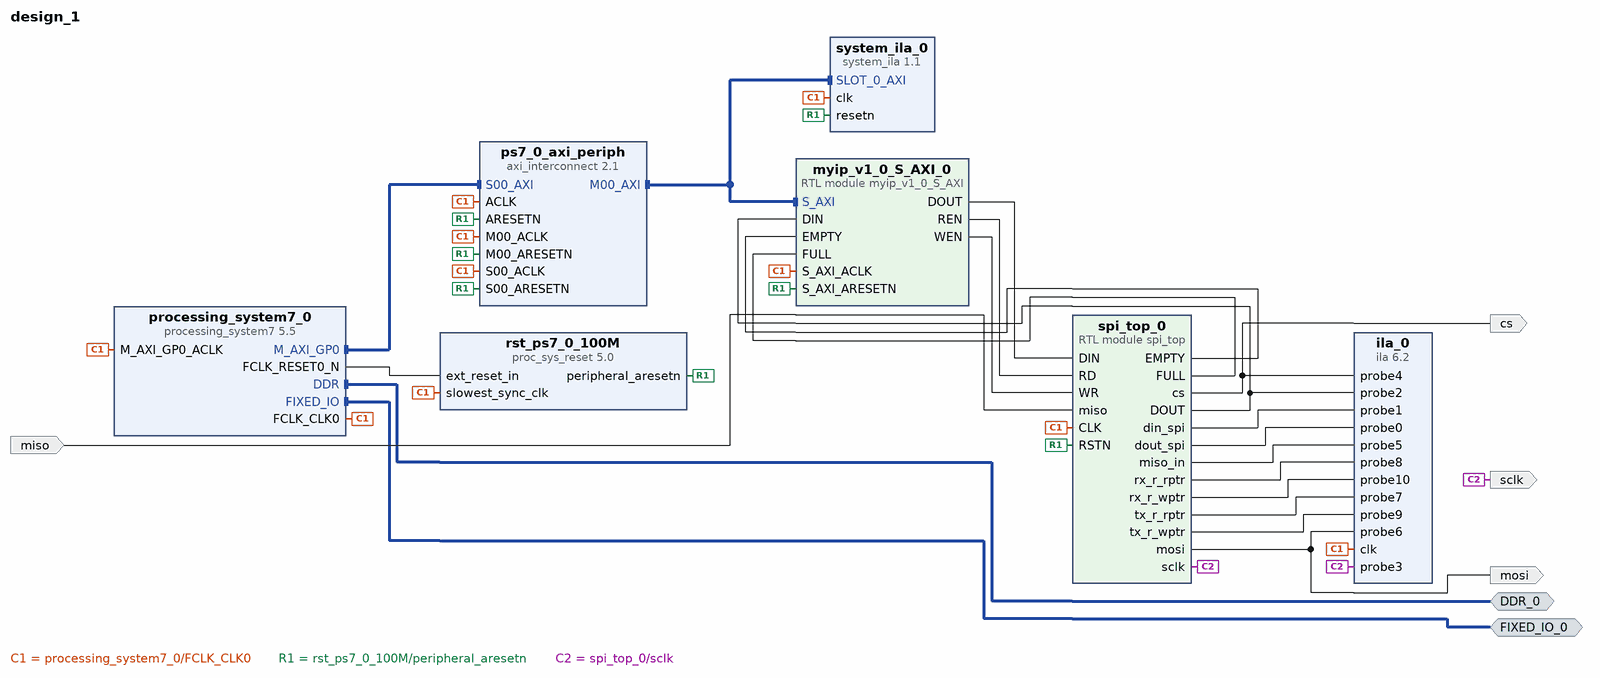
[diagram p0: block diagram of the top level]
# Vivado block design design_1, xc7z007sclg400-1, Vivado 2024.1
create_bd_design design_1

create_bd_intf_port -mode Master -vlnv xilinx.com:interface:ddrx_rtl:1.0 DDR_0
create_bd_intf_port -mode Master -vlnv xilinx.com:display_processing_system7:fixedio_rtl:1.0 FIXED_IO_0
create_bd_port -dir O mosi
create_bd_port -dir O sclk
create_bd_port -dir O cs
create_bd_port -dir I miso

create_bd_cell -type module -reference myip_v1_0_S_AXI myip_v1_0_S_AXI_0
create_bd_cell -type ip -vlnv xilinx.com:ip:axi_interconnect:2.1 ps7_0_axi_periph
set_property -dict {CONFIG.NUM_MI 1} [get_bd_cells ps7_0_axi_periph]
create_bd_cell -type ip -vlnv xilinx.com:ip:proc_sys_reset:5.0 rst_ps7_0_100M
create_bd_cell -type module -reference spi_top spi_top_0
create_bd_cell -type ip -vlnv xilinx.com:ip:processing_system7:5.5 processing_system7_0
set_property -dict [list \
  CONFIG.PCW_APU_PERIPHERAL_FREQMHZ 650 \
  CONFIG.PCW_CRYSTAL_PERIPHERAL_FREQMHZ 50 \
  CONFIG.PCW_ENET0_ENET0_IO {MIO 16 .. 27} \
  CONFIG.PCW_ENET0_GRP_MDIO_ENABLE 1 \
  CONFIG.PCW_ENET0_GRP_MDIO_IO {MIO 52 .. 53} \
  CONFIG.PCW_ENET0_PERIPHERAL_ENABLE 1 \
  CONFIG.PCW_ENET0_RESET_ENABLE 1 \
  CONFIG.PCW_ENET0_RESET_IO {MIO 9} \
  CONFIG.PCW_ENET_RESET_ENABLE 1 \
  CONFIG.PCW_ENET_RESET_SELECT {Share reset pin} \
  CONFIG.PCW_FPGA0_PERIPHERAL_FREQMHZ 100 \
  CONFIG.PCW_GPIO_MIO_GPIO_ENABLE 1 \
  CONFIG.PCW_GPIO_MIO_GPIO_IO MIO \
  CONFIG.PCW_I2C_RESET_ENABLE 1 \
  CONFIG.PCW_PRESET_BANK1_VOLTAGE {LVCMOS 1.8V} \
  CONFIG.PCW_QSPI_PERIPHERAL_ENABLE 0 \
  CONFIG.PCW_SD0_GRP_CD_ENABLE 1 \
  CONFIG.PCW_SD0_GRP_CD_IO {MIO 47} \
  CONFIG.PCW_SD0_GRP_WP_ENABLE 0 \
  CONFIG.PCW_SD0_PERIPHERAL_ENABLE 1 \
  CONFIG.PCW_SD0_SD0_IO {MIO 40 .. 45} \
  CONFIG.PCW_SDIO_PERIPHERAL_FREQMHZ 100 \
  CONFIG.PCW_UART0_PERIPHERAL_ENABLE 1 \
  CONFIG.PCW_UART0_UART0_IO {MIO 14 .. 15} \
  CONFIG.PCW_UART_PERIPHERAL_FREQMHZ 100 \
  CONFIG.PCW_UIPARAM_DDR_BUS_WIDTH {16 Bit} \
  CONFIG.PCW_UIPARAM_DDR_FREQ_MHZ 525 \
  CONFIG.PCW_UIPARAM_DDR_PARTNO {MT41K256M16 RE-125} \
  CONFIG.PCW_USB0_PERIPHERAL_ENABLE 0 \
  CONFIG.PCW_USB0_RESET_ENABLE 1 \
  CONFIG.PCW_USB0_RESET_IO {MIO 46} \
  CONFIG.PCW_USB_RESET_ENABLE 1 \
] [get_bd_cells processing_system7_0]
# 292 more settings of processing_system7_0 are not shown: defaults, MIO pin electricals, DDR timing, and values the tool derives
create_bd_cell -type ip -vlnv xilinx.com:ip:system_ila:1.1 system_ila_0
set_property -dict {CONFIG.C_MON_TYPE INTERFACE} [get_bd_cells system_ila_0]
create_bd_cell -type ip -vlnv xilinx.com:ip:ila:6.2 ila_0
set_property -dict [list \
  CONFIG.C_MONITOR_TYPE Native \
  CONFIG.C_NUM_OF_PROBES 11 \
  CONFIG.C_PROBE0_WIDTH 8 \
  CONFIG.C_PROBE10_WIDTH 4 \
  CONFIG.C_PROBE1_WIDTH 8 \
  CONFIG.C_PROBE2_WIDTH 8 \
  CONFIG.C_PROBE3_WIDTH 1 \
  CONFIG.C_PROBE7_WIDTH 4 \
  CONFIG.C_PROBE8_WIDTH 4 \
  CONFIG.C_PROBE9_WIDTH 4 \
] [get_bd_cells ila_0]

# ---- connections ----

connect_bd_intf_net [get_bd_intf_ports DDR_0] [get_bd_intf_pins processing_system7_0/DDR]
connect_bd_intf_net [get_bd_intf_ports FIXED_IO_0] [get_bd_intf_pins processing_system7_0/FIXED_IO]
connect_bd_intf_net [get_bd_intf_pins processing_system7_0/M_AXI_GP0] [get_bd_intf_pins ps7_0_axi_periph/S00_AXI]
connect_bd_intf_net -intf_net ps7_0_axi_periph_M00_AXI [get_bd_intf_pins ps7_0_axi_periph/M00_AXI] [get_bd_intf_pins myip_v1_0_S_AXI_0/S_AXI]
connect_bd_intf_net [get_bd_intf_pins ps7_0_axi_periph/M00_AXI] [get_bd_intf_pins system_ila_0/SLOT_0_AXI]
connect_bd_net [get_bd_ports miso] [get_bd_pins spi_top_0/miso]
connect_bd_net [get_bd_pins myip_v1_0_S_AXI_0/DOUT] [get_bd_pins spi_top_0/DIN]
connect_bd_net [get_bd_pins myip_v1_0_S_AXI_0/REN] [get_bd_pins spi_top_0/RD]
connect_bd_net [get_bd_pins myip_v1_0_S_AXI_0/WEN] [get_bd_pins spi_top_0/WR]
connect_bd_net [get_bd_pins processing_system7_0/FCLK_CLK0] \
  [get_bd_pins rst_ps7_0_100M/slowest_sync_clk] [get_bd_pins processing_system7_0/M_AXI_GP0_ACLK] [get_bd_pins ila_0/clk] \
  [get_bd_pins ps7_0_axi_periph/ACLK] [get_bd_pins ps7_0_axi_periph/S00_ACLK] [get_bd_pins ps7_0_axi_periph/M00_ACLK] \
  [get_bd_pins system_ila_0/clk] [get_bd_pins spi_top_0/CLK] [get_bd_pins myip_v1_0_S_AXI_0/S_AXI_ACLK]
connect_bd_net [get_bd_pins processing_system7_0/FCLK_RESET0_N] [get_bd_pins rst_ps7_0_100M/ext_reset_in]
connect_bd_net [get_bd_pins rst_ps7_0_100M/peripheral_aresetn] \
  [get_bd_pins ps7_0_axi_periph/ARESETN] [get_bd_pins ps7_0_axi_periph/S00_ARESETN] \
  [get_bd_pins ps7_0_axi_periph/M00_ARESETN] [get_bd_pins system_ila_0/resetn] [get_bd_pins spi_top_0/RSTN] \
  [get_bd_pins myip_v1_0_S_AXI_0/S_AXI_ARESETN]
connect_bd_net [get_bd_pins spi_top_0/DOUT] [get_bd_pins ila_0/probe2] [get_bd_pins myip_v1_0_S_AXI_0/DIN]
connect_bd_net [get_bd_pins spi_top_0/EMPTY] [get_bd_pins myip_v1_0_S_AXI_0/EMPTY]
connect_bd_net [get_bd_pins spi_top_0/FULL] [get_bd_pins myip_v1_0_S_AXI_0/FULL]
connect_bd_net [get_bd_pins spi_top_0/cs] [get_bd_pins ila_0/probe4] [get_bd_ports cs]
connect_bd_net [get_bd_pins spi_top_0/din_spi] [get_bd_pins ila_0/probe1]
connect_bd_net [get_bd_pins spi_top_0/dout_spi] [get_bd_pins ila_0/probe0]
connect_bd_net [get_bd_pins spi_top_0/miso_in] [get_bd_pins ila_0/probe5]
connect_bd_net [get_bd_pins spi_top_0/mosi] [get_bd_ports mosi] [get_bd_pins ila_0/probe6]
connect_bd_net [get_bd_pins spi_top_0/rx_r_rptr] [get_bd_pins ila_0/probe8]
connect_bd_net [get_bd_pins spi_top_0/rx_r_wptr] [get_bd_pins ila_0/probe10]
connect_bd_net [get_bd_pins spi_top_0/sclk] [get_bd_pins ila_0/probe3] [get_bd_ports sclk]
connect_bd_net [get_bd_pins spi_top_0/tx_r_rptr] [get_bd_pins ila_0/probe7]
connect_bd_net [get_bd_pins spi_top_0/tx_r_wptr] [get_bd_pins ila_0/probe9]
set_property HDL_ATTRIBUTE.DEBUG true [get_bd_intf_nets ps7_0_axi_periph_M00_AXI]
set_property HDL_ATTRIBUTE.MARK_DEBUG true [get_bd_intf_nets ps7_0_axi_periph_M00_AXI]

# ---- address map ----
assign_bd_address -offset 0x40000000 -range 4K -target_address_space [get_bd_addr_spaces processing_system7_0/Data] [get_bd_addr_segs myip_v1_0_S_AXI_0/S_AXI/reg0]

validate_bd_design
save_bd_design
